# EAGLE design Konekt_Dash (EAGLE 6.5.0)
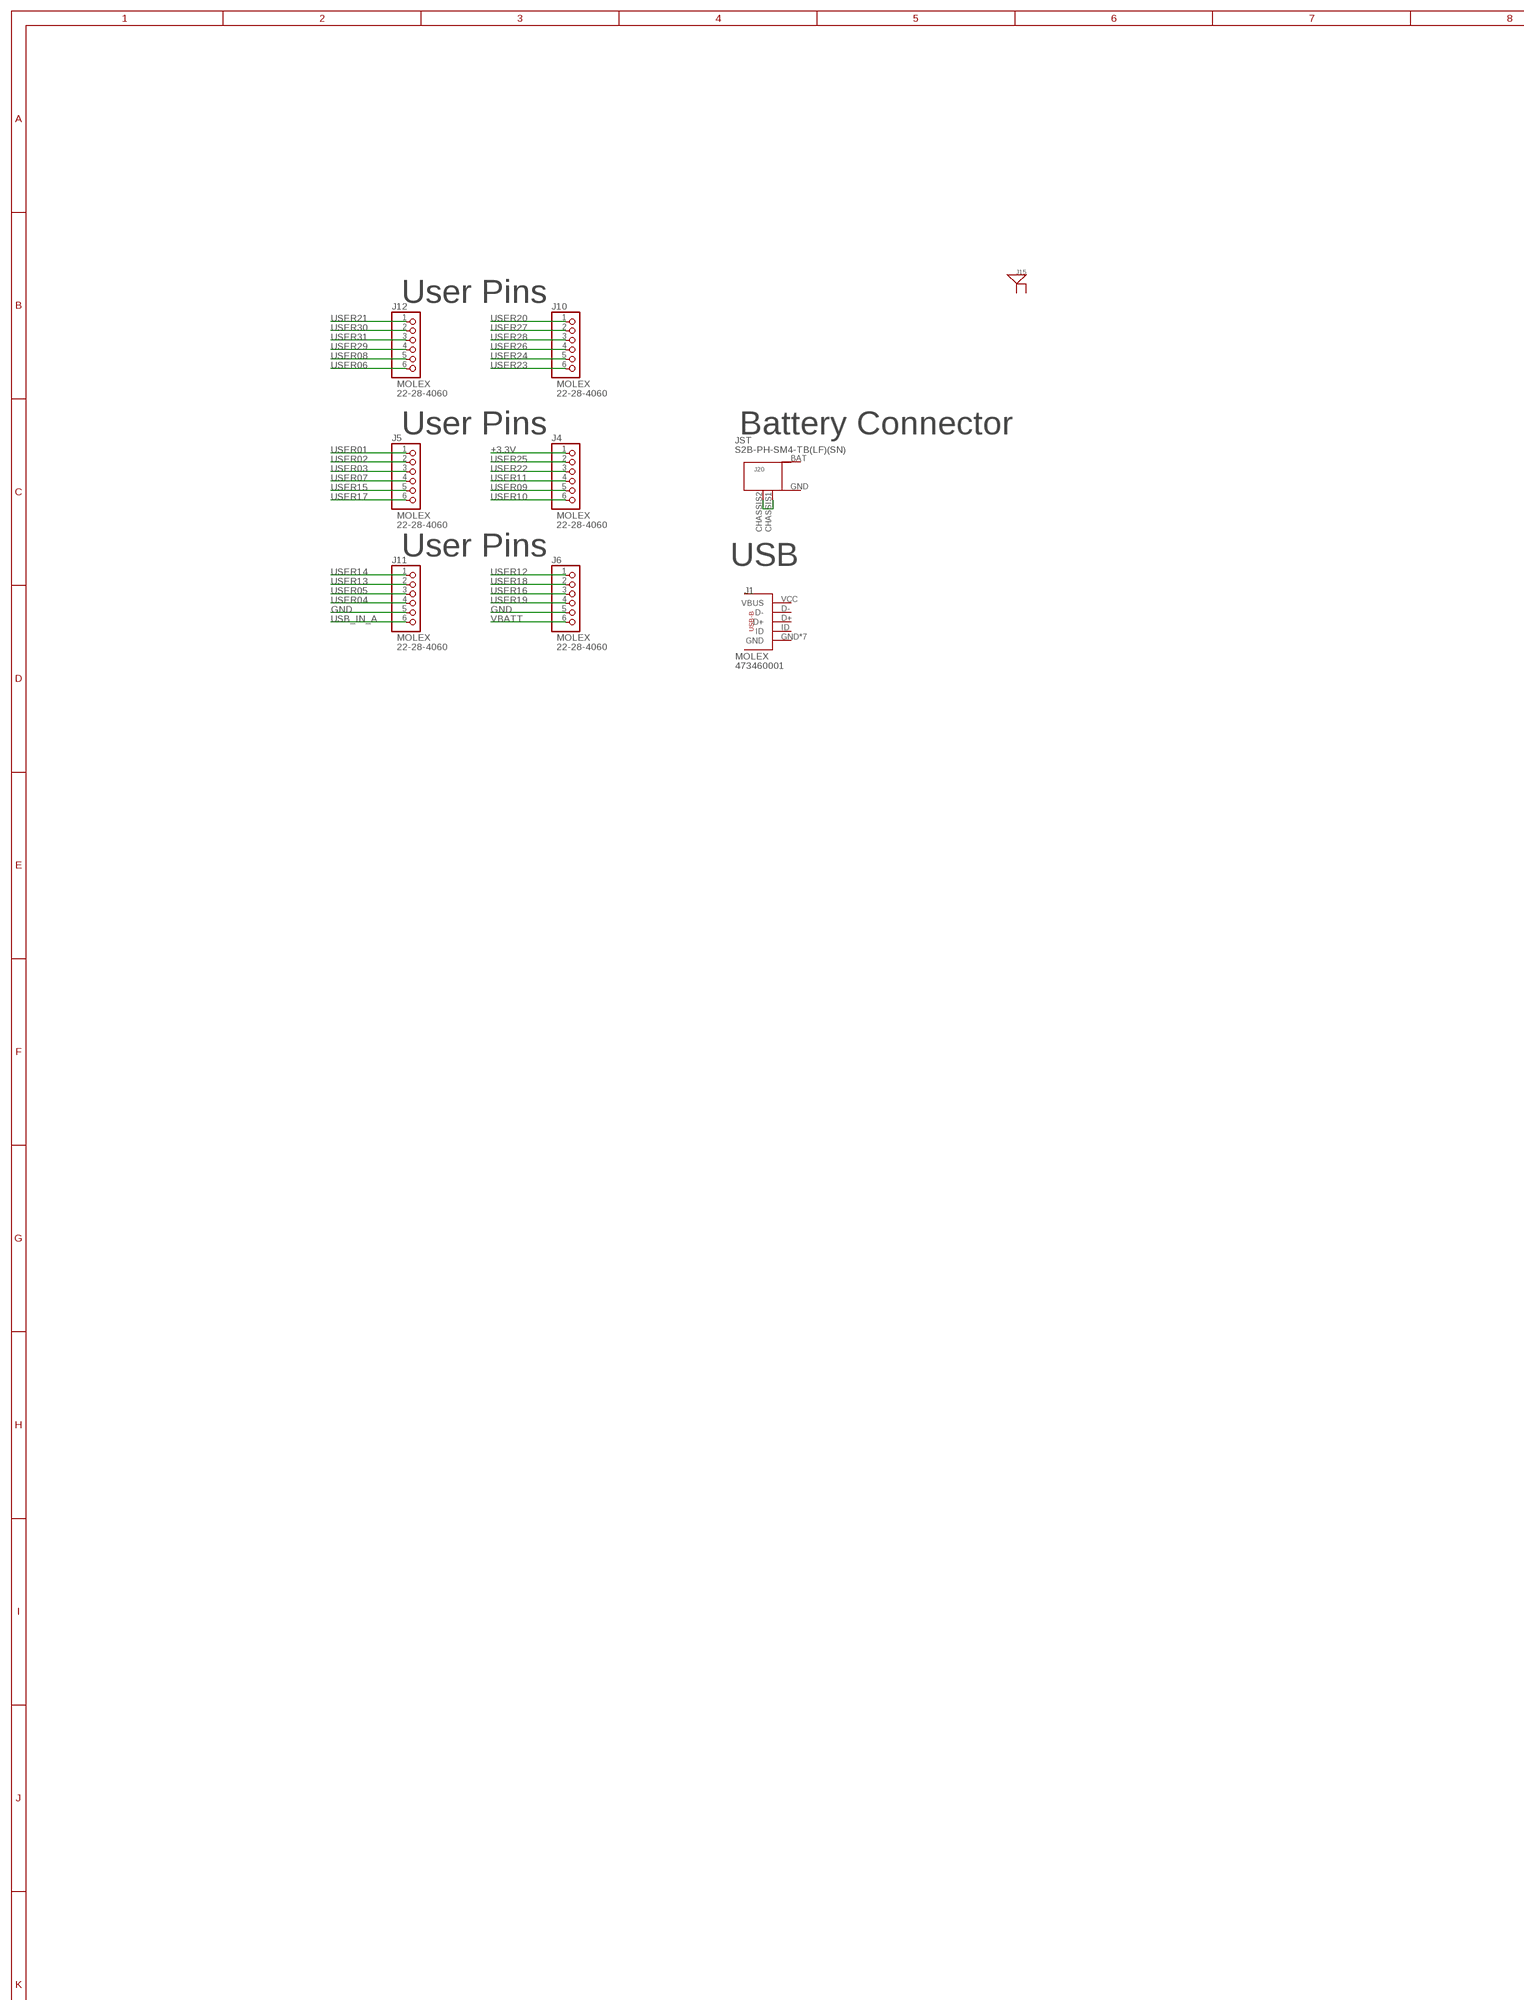
[diagram p0: schematic, sheet 1, part 1 of 3]
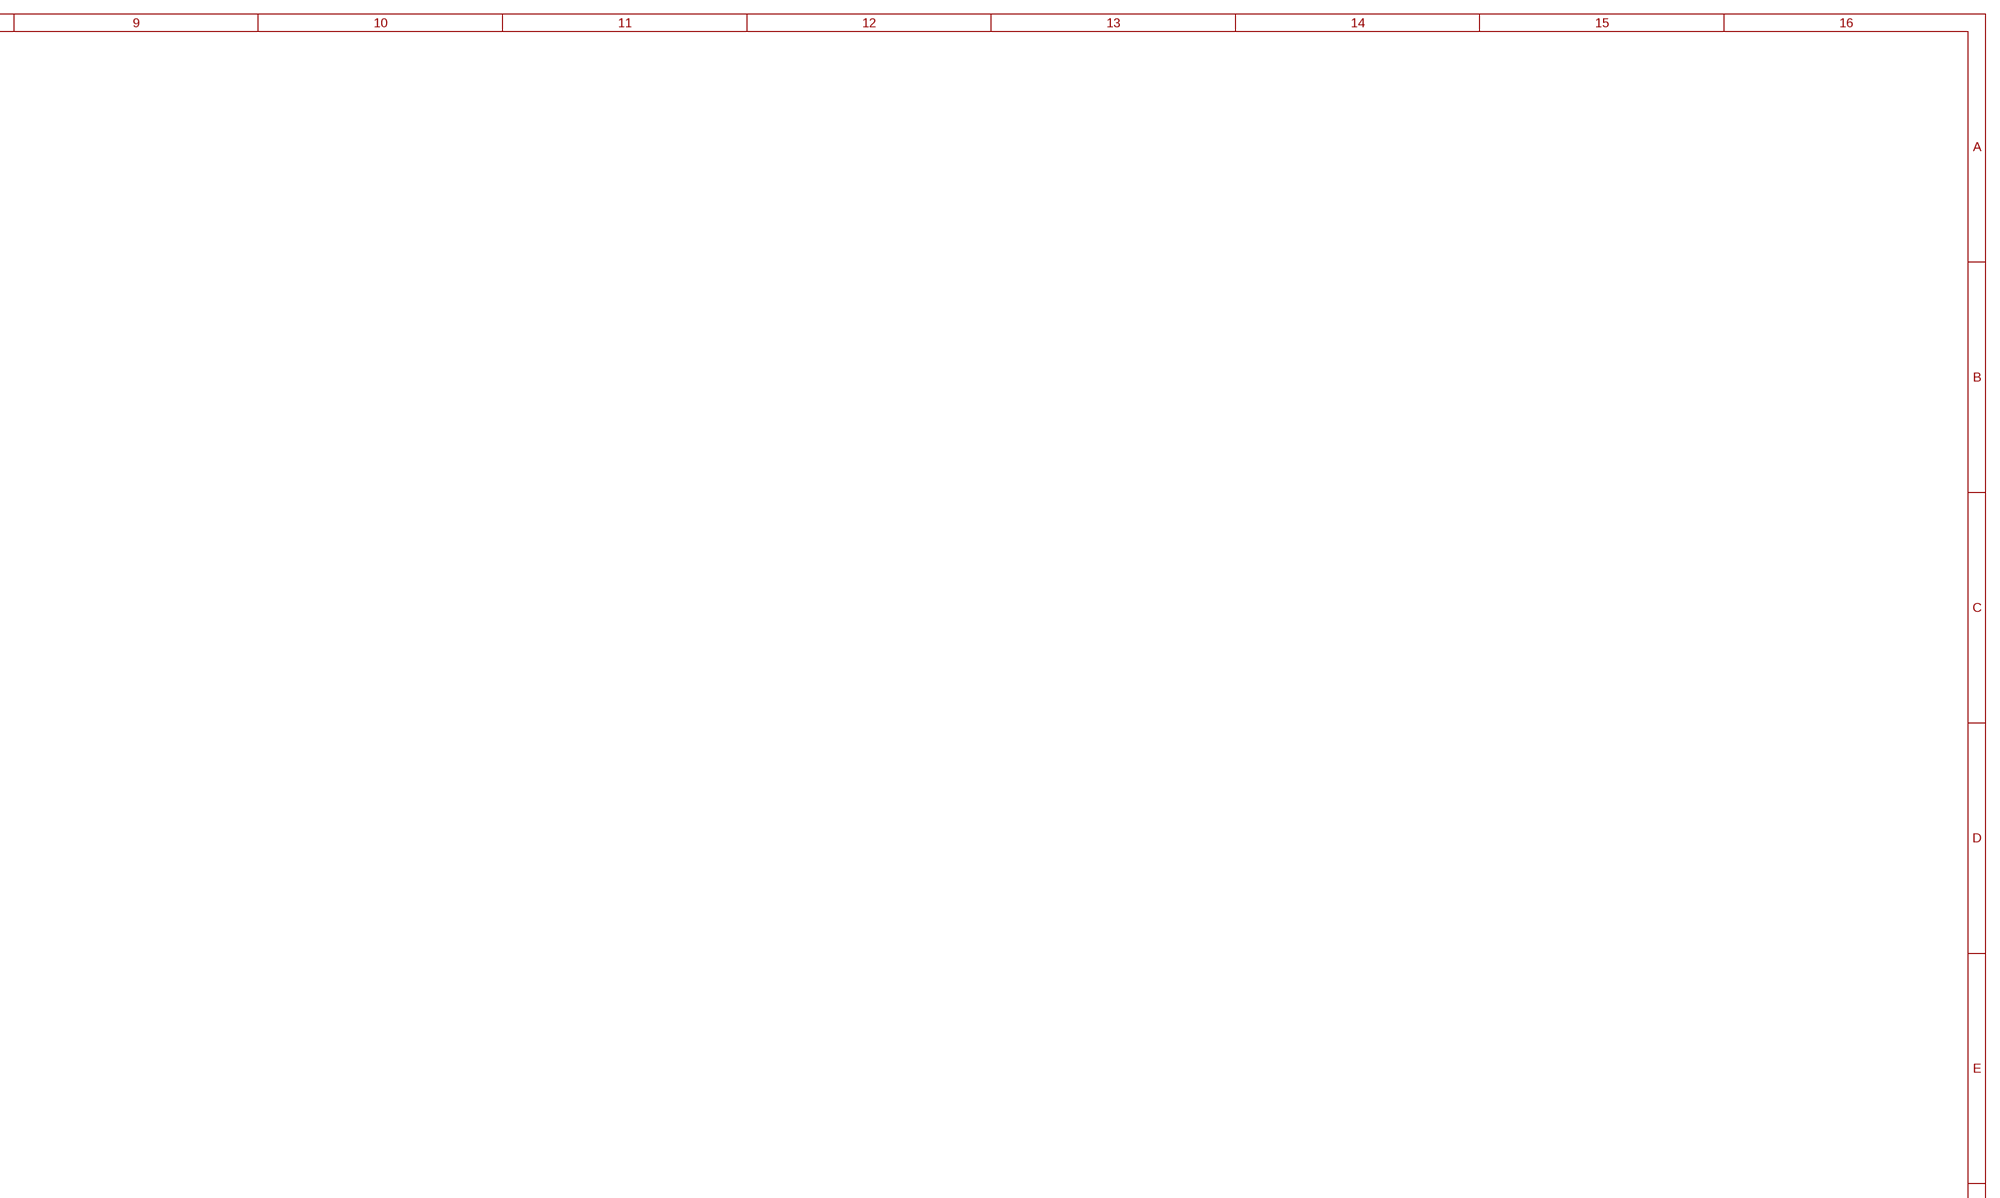
[diagram p1: schematic, sheet 1, part 2 of 3]
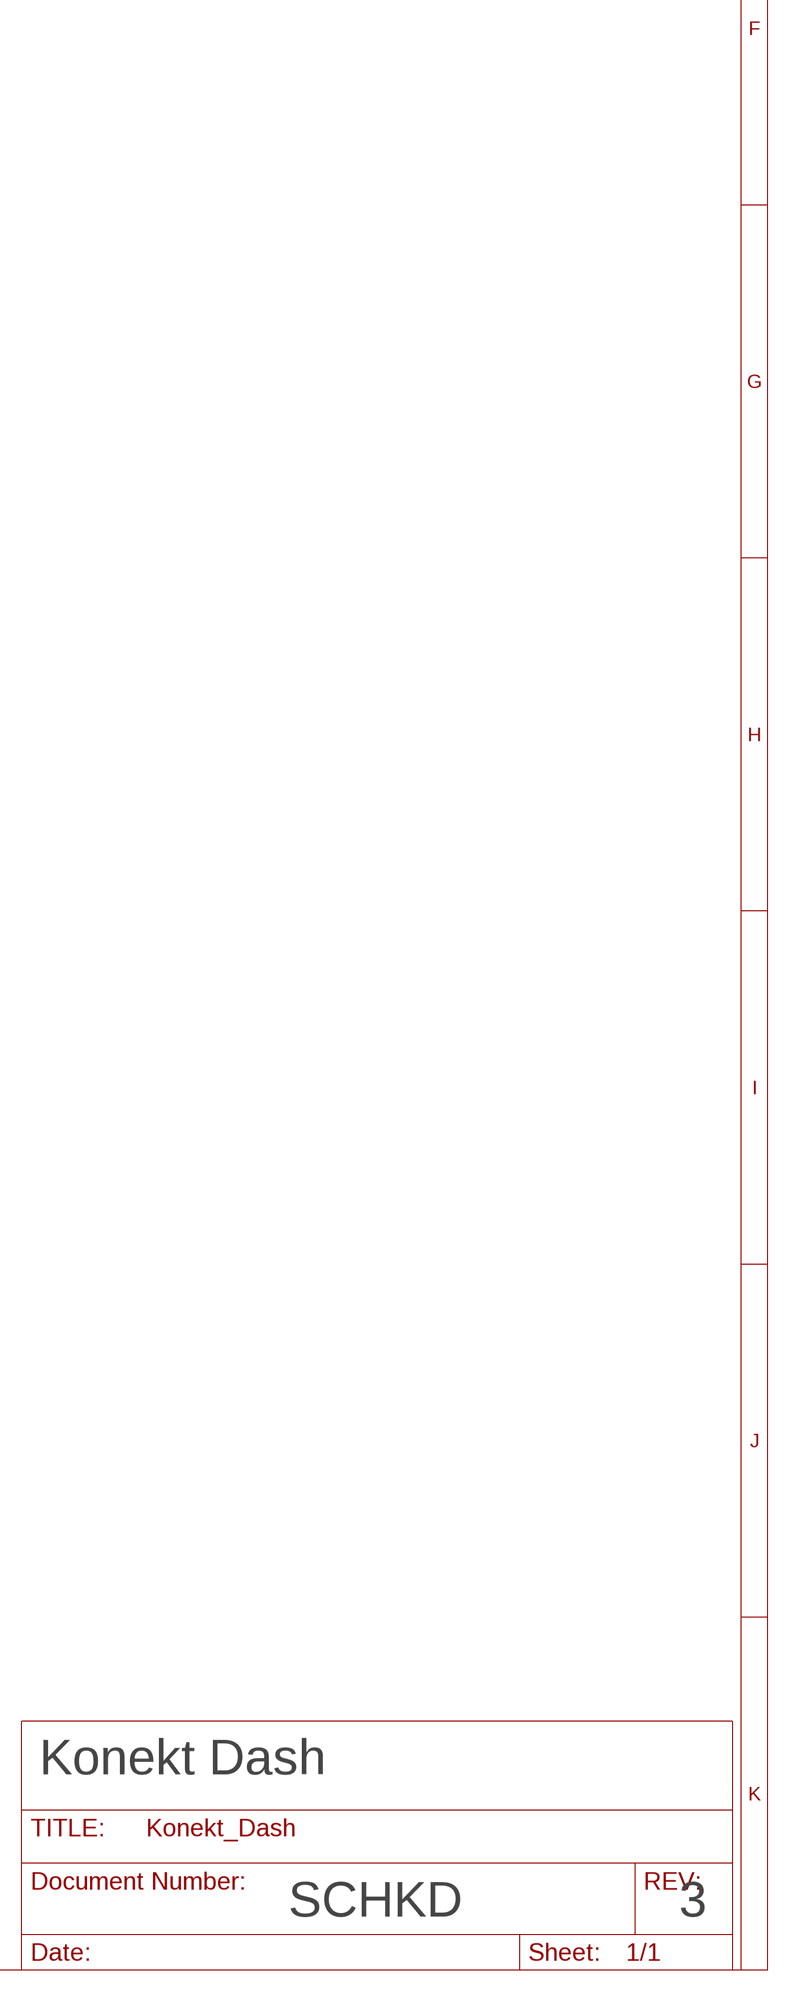
[diagram p2: schematic, sheet 1, part 3 of 3]

## Parts
J1  USB_MICRO_B_MOLEX_473460001  [USB_MICRO_MOLEX_473460001]
J4  PINHD-1X6  [1X06]
J5  PINHD-1X6  [1X06]
J6  PINHD-1X6  [1X06]
J10  PINHD-1X6  [1X06]
J11  PINHD-1X6  [1X06]
J12  PINHD-1X6  [1X06]
J15  ANT_UFL  [U.FL_CONNECTOR]
J20  BAT_TERM  [JST-PH-2]

## Nets
+3.3V: J4.1
GND [gnd]: J6.5 J11.5
N$2 [gnd]: J20.CHASSIS1(CHASSIS_1) J20.CHASSIS2(CHASSIS_2)
USB_IN_A: J11.6
USER01 [HIGH_SPEED]: J5.1
USER02 [HIGH_SPEED]: J5.2
USER03 [HIGH_SPEED]: J5.3
USER04 [HIGH_SPEED]: J11.4
USER05 [HIGH_SPEED]: J11.3
USER06 [HIGH_SPEED]: J12.6
USER07 [HIGH_SPEED]: J5.4
USER08 [HIGH_SPEED]: J12.5
USER09 [HIGH_SPEED]: J4.5
USER10 [HIGH_SPEED]: J4.6
USER11 [HIGH_SPEED]: J4.4
USER12 [HIGH_SPEED]: J6.1
USER13 [HIGH_SPEED]: J11.2
USER14 [HIGH_SPEED]: J11.1
USER15 [HIGH_SPEED]: J5.5
USER16 [HIGH_SPEED]: J6.3
USER17 [HIGH_SPEED]: J5.6
USER18 [HIGH_SPEED]: J6.2
USER19 [HIGH_SPEED]: J6.4
USER20: J10.1
USER21: J12.1
USER22 [HIGH_SPEED]: J4.3
USER23 [HIGH_SPEED]: J10.6
USER24: J10.5
USER25: J4.2
USER26: J10.4
USER27: J10.2
USER28 [HIGH_SPEED]: J10.3
USER29 [HIGH_SPEED]: J12.4
USER30 [HIGH_SPEED]: J12.2
USER31 [HIGH_SPEED]: J12.3
VBATT: J6.6
Unconnected: J1.D+ J1.D- J1.GND J1.GND$1(GND) J1.GND$2(GND) J1.GND$3(GND) J1.GND$4(GND) J1.GND$5(GND) J1.GND$6(GND) J1.ID J1.VCC(VBUS) J15.1(ANT) J15.2(GND) J15.3(GND) J20.BAT J20.GND

## Notes on the sheet
- User Pins
- User Pins | Battery Connector
- User Pins | USB
- Konekt Dash
- SCHKD | 3

## Library data of the parts
J1 = konekt:USB_MICRO_B_MOLEX_473460001; MFG: MOLEX; MPN: 473460001; PACKAGE: CUSTOM; PARTNUM: 473460001
J4-J6 J10-J12 = pinhead:PINHD-1X6: PIN HEADER; MFG: MOLEX; MPN: 22-28-4060; PACKAGE: CUSTOM
J15 = konekt:ANT_UFL; MFG: AMPHENOL RF; MPN: A-1JA; PACKAGE: U.FL
J20 = DDL:BAT_TERM; HEIGHT: 4.8; LENGTH: 9.6; MFG: JST; MPN: S2B-PH-SM4-TB(LF)(SN); PACKAGE: JST-2; PARTNUM: S2B-PH-SM4-TB(LF)(SN); WIDTH: 5.8

## Net classes
1 power: width 0.406 mm, drill 0.61 mm, clearance 0.152 mm
2 gnd: width 0.203 mm, drill 0.203 mm, clearance 0.152 mm
3 usbvcc: width 0.203 mm, drill 0.61 mm, clearance 0.152 mm
4 aref: width 0.203 mm, drill 0.61 mm, clearance 0.152 mm
5 Vbatt: width 2.5 mm, drill 1 mm, clearance 0.125 mm
6 HIGH_SPEED: width 0.155 mm, drill 0.203 mm, clearance 0.152 mm
7 DIFF_HIGH_SPEED: width 0.157 mm, drill 0.203 mm, clearance 0.152 mm

## Board
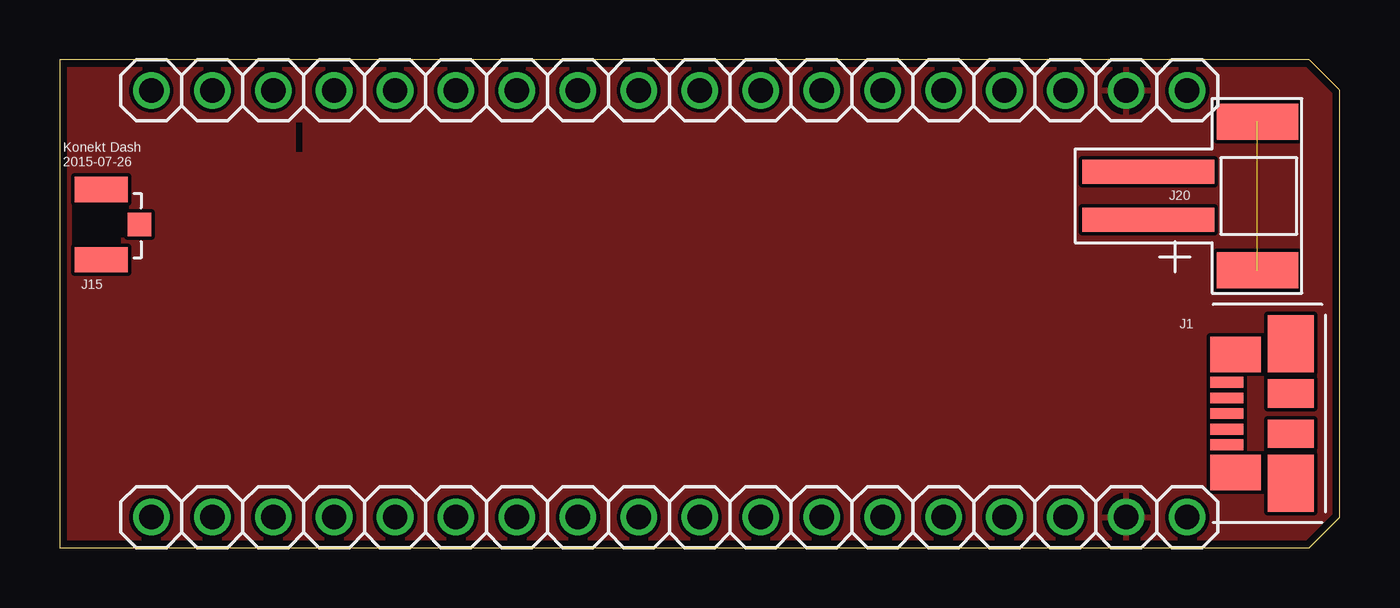
[diagram p3: board, top side]
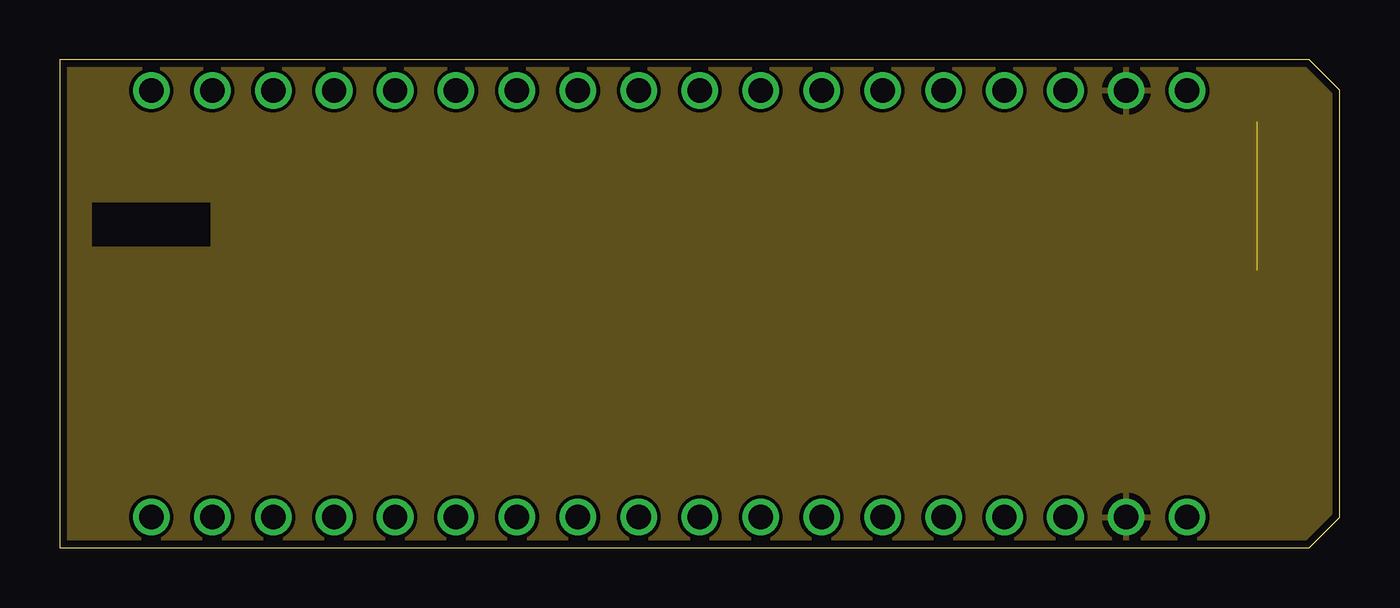
[diagram p4: board, inner layer GND2]
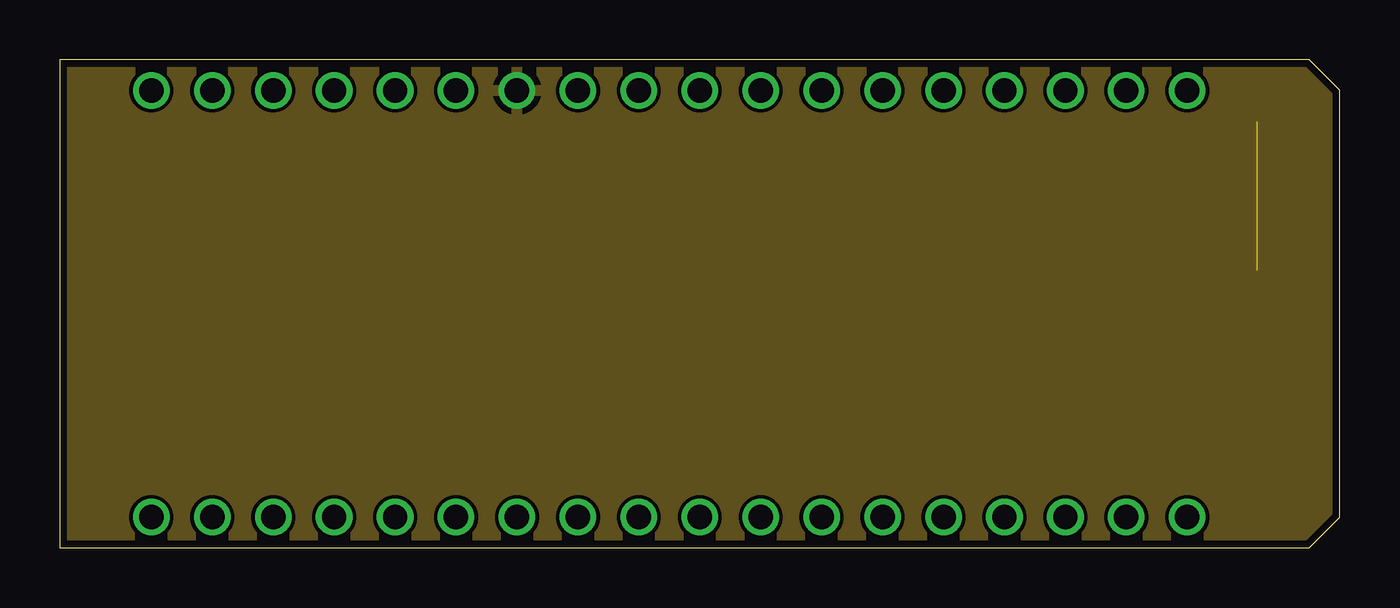
[diagram p5: board, inner layer PWR]
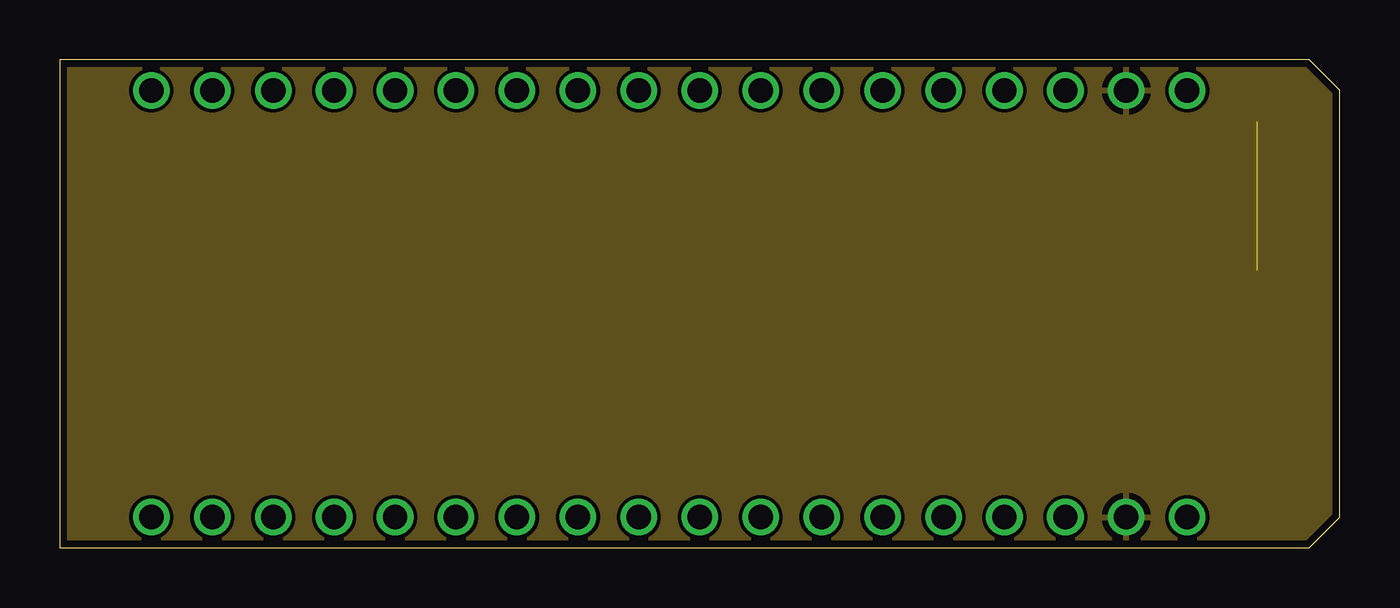
[diagram p6: board, inner layer Route4]
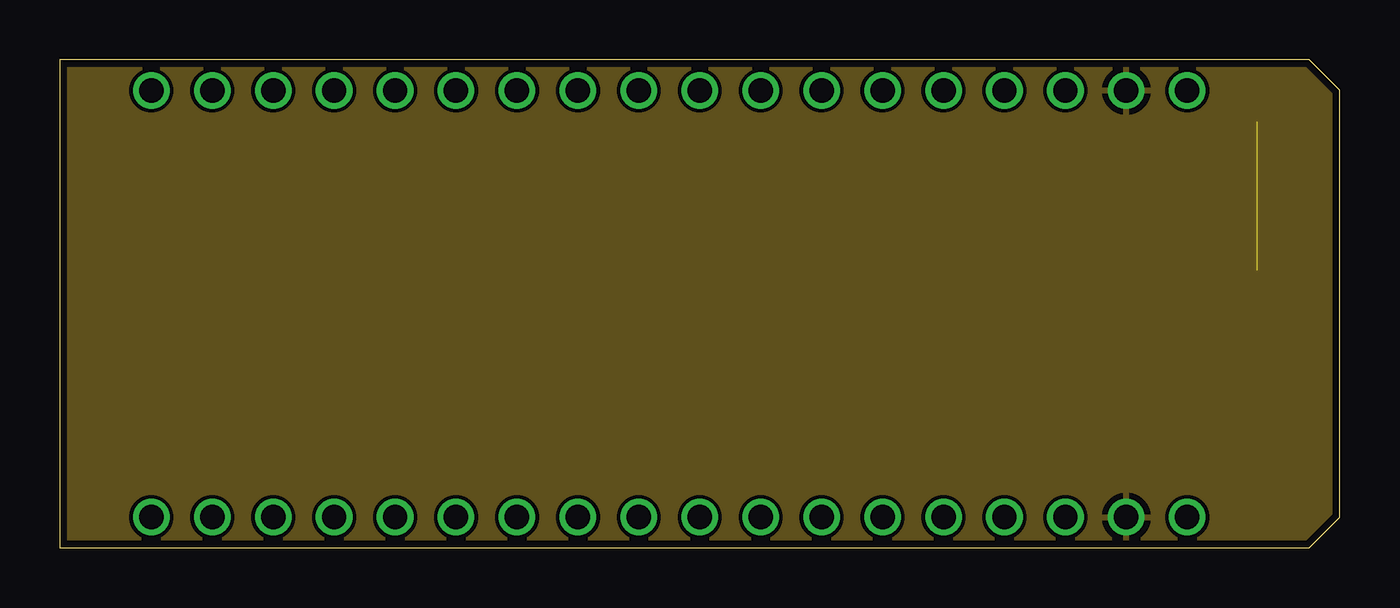
[diagram p7: board, inner layer GND13]
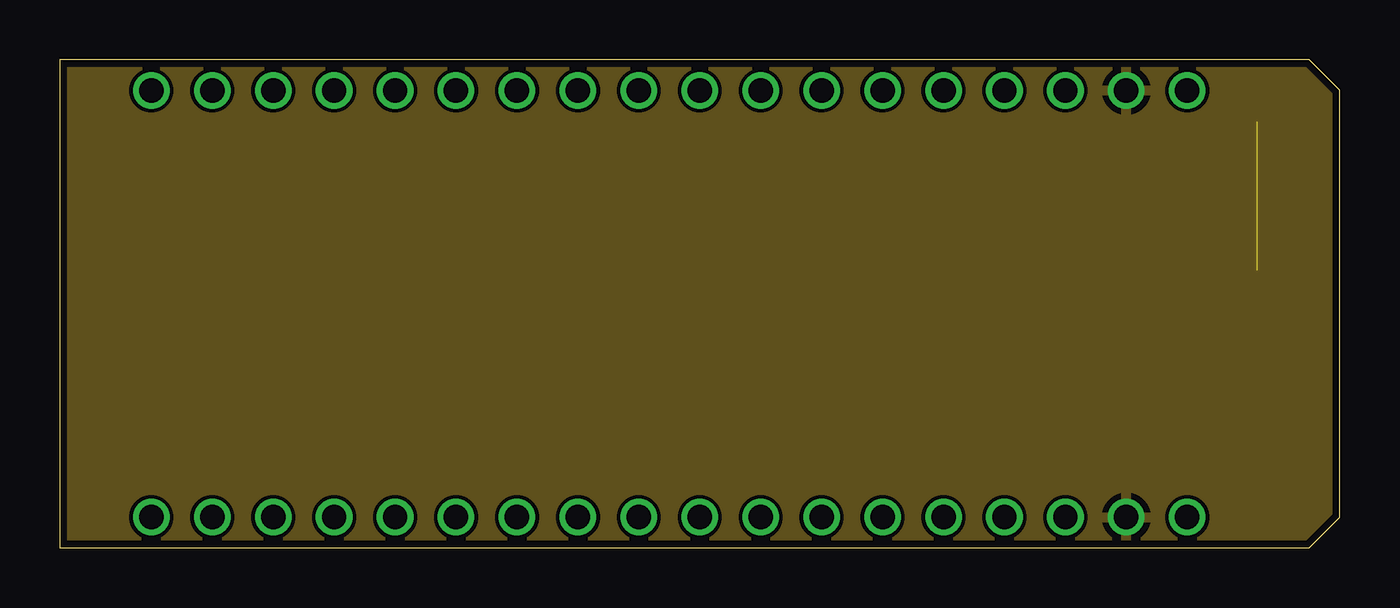
[diagram p8: board, inner layer Route14]
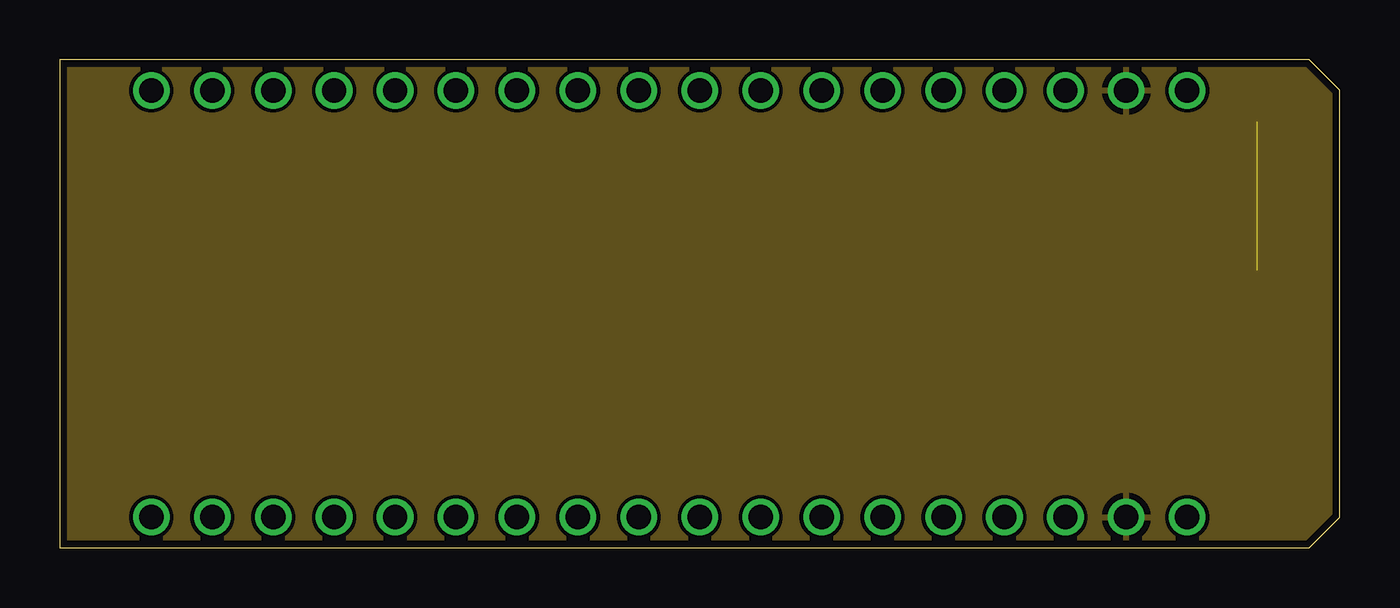
[diagram p9: board, inner layer GND15]
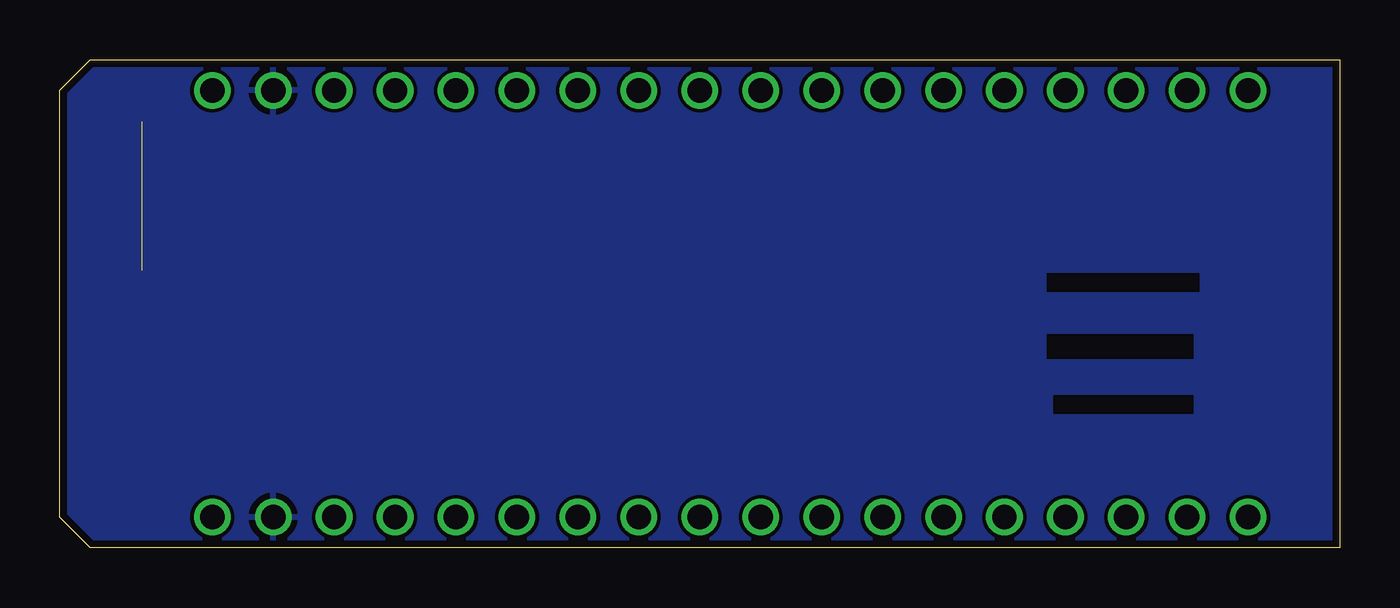
[diagram p10: board, bottom side, seen from below]

Size 53.34 x 20.32 mm. Coordinates in mm from the lower left corner, seen from the top.
Outline: 0,0 52.07,0 53.34,1.27 53.34,19.05 52.07,20.32 0,20.32 0,0
Copper layers (1*2*3*4*13*14*15*16): Top 0.01778125mm / dielectric 6.5mil / GND2 0.01778125mm / dielectric 0.5024125mm / PWR 0.01778125mm / dielectric 6.5mil / Route4 0.01778125mm / dielectric 6.5mil / GND13 0.01778125mm / dielectric 6.5mil / Route14 0.01778125mm / dielectric 0.5024125mm / GND15 0.01778125mm / dielectric 6.5mil / Bottom 0.01778125mm
Design rules "default *": minimum track width 6mil, minimum drill 8mil, track to track 6mil, track to pad 6mil, pad to pad 6mil, via to via 6mil, smd to smd 6mil, copper to edge 12mil, drill to drill 8mil, minimum pad ring 10mil, minimum via ring 8mil, stop-mask expansion 4mil, vias tented up to drill 0mil, thermal gap 10mil
tRestrict: area 9.9,16.5 to 10.1,17.7
bRestrict: area 5.8,10.7 to 12.2,11.4; area 6.1,7.9 to 12.2,8.9; area 6.1,5.6 to 11.9,6.3

### Footprints (pad centres in the part's own frame; a part is rotated, then mirrored left to right if it is on the bottom)
USB_MICRO_MOLEX_473460001 = smd 1.38 x 0.45: D+ 2.66,0; D- 2.66,0.65; GND 2.66,-1.3; ID 2.66,-0.65; VCC 2.66,1.3 | smd 1.9 x 2.375: GND$1 0,2.913; GND$4 0,-2.913 | smd 1.9 x 1.175: GND$2 0,0.838; GND$3 0,-0.838 | smd 2.1 x 1.475: GND$5 2.3,2.462; GND$6 2.3,-2.462
1X06 = drill 1.016: 1 -6.35,0; 2 -3.81,0; 3 -1.27,0; 4 1.27,0; 5 3.81,0; 6 6.35,0
U.FL_CONNECTOR = smd 0.99 x 0.99: 1 0,1.535 | smd 1.055 x 2.21: 2 -1.468,-0.065; 3 1.468,-0.065
JST-PH-2 = smd 1 x 5.5: BAT 1,-1.75; GND -1,-1.75 | smd 1.5 x 3.4: CHASSIS1 -3.1,2.8; CHASSIS2 3.1,2.8

### Placement (x,y rotation side)
J1  51.31,5.59 180 top
J4  25.4,19.05 0 top
J5  25.4,1.27 0 top
J6  40.64,19.05 0 top
J10  10.16,19.05 0 top
J11  40.64,1.27 0 top
J12  10.16,1.27 0 top
J15  1.78,13.46 270 top
J20  47.12,14.66 270 top

### Tracks (layer width: path | path; a pad name or v marks a point on that pad's centre or on a via)
+3.3V
  pour PWR: 0,20.32 0,0 53.34,0 53.34,20.32
GND
  pour GND15: 0,20.32 0,0 54.48,0.25 54.74,20.83
  pour Top: 0,20.32 0,0 53.34,0 53.34,20.32
  pour Bottom: 0,20.32 0,0 53.34,0 53.34,20.32
  pour GND2: 0,20.32 0,14.48 6.35,14.48 6.35,12.45 0,12.45 0,0 53.34,0 53.34,20.32
  pour GND2: 0,15.24 0,11.43 1.27,11.43 1.27,15.24
  pour Route4: 0,20.32 0,0 53.34,0 53.34,20.32
  pour GND13: 0,20.32 0,0 53.34,0 53.34,20.32
  pour Route14: 0,20.32 0,0 53.34,0 53.34,20.32
  pour Route14: 0,20.32 0,0 53.34,0 53.34,20.32
N$2  (1 unrouted)

### Text on the board
tNames: Konekt Dash / 2015-07-26
Document: 1 | 2 | 3 | 4 | 5 | 6 | A | A | B | B | C | C | Board Material: FR-4 / Net Class: DIFF_PAIR 100 Ohm controlled impedance signified by 6.1 mil traces / Net Class: HIGH_SPEED 50 Ohm controlled impedance signified by 6.2 mil traces / Net Class: ANT 50 Ohm Coplanar Waveguide signified by 10.7 mil traces. / TG Rating TG170 / Finish: ENIG / Lead Free ROHS / All layers 0.5 oz copper / Through Vias only, no blind nor buried vias / Via-in-pad signified by 11.1, 8.1 mil vias / PCB Color Light Grey " R:233 G:236 B:239 #e9ecef" / Silkscreen in black | Top Layer | Layer 2 (GND) | Layer 3 (PWR) | Layer 4 Route | 62 Mils | Layer 13 (GND) | Layer 14 Route | Layer 15 (GND) | Bottom Layer | DWN: | PCB2001-R3A | DWG DDL | D | D | 2015-08-28 | KONEKT IOT CELLULAR GATEWAY | Konekt Data, all rights reserved / Confidential and Proprietary | 1 | 2 | 4 | 5 | 6